# EAGLE design lia_breakout (EAGLE 6.5.0)

## Sheet 1 of 3
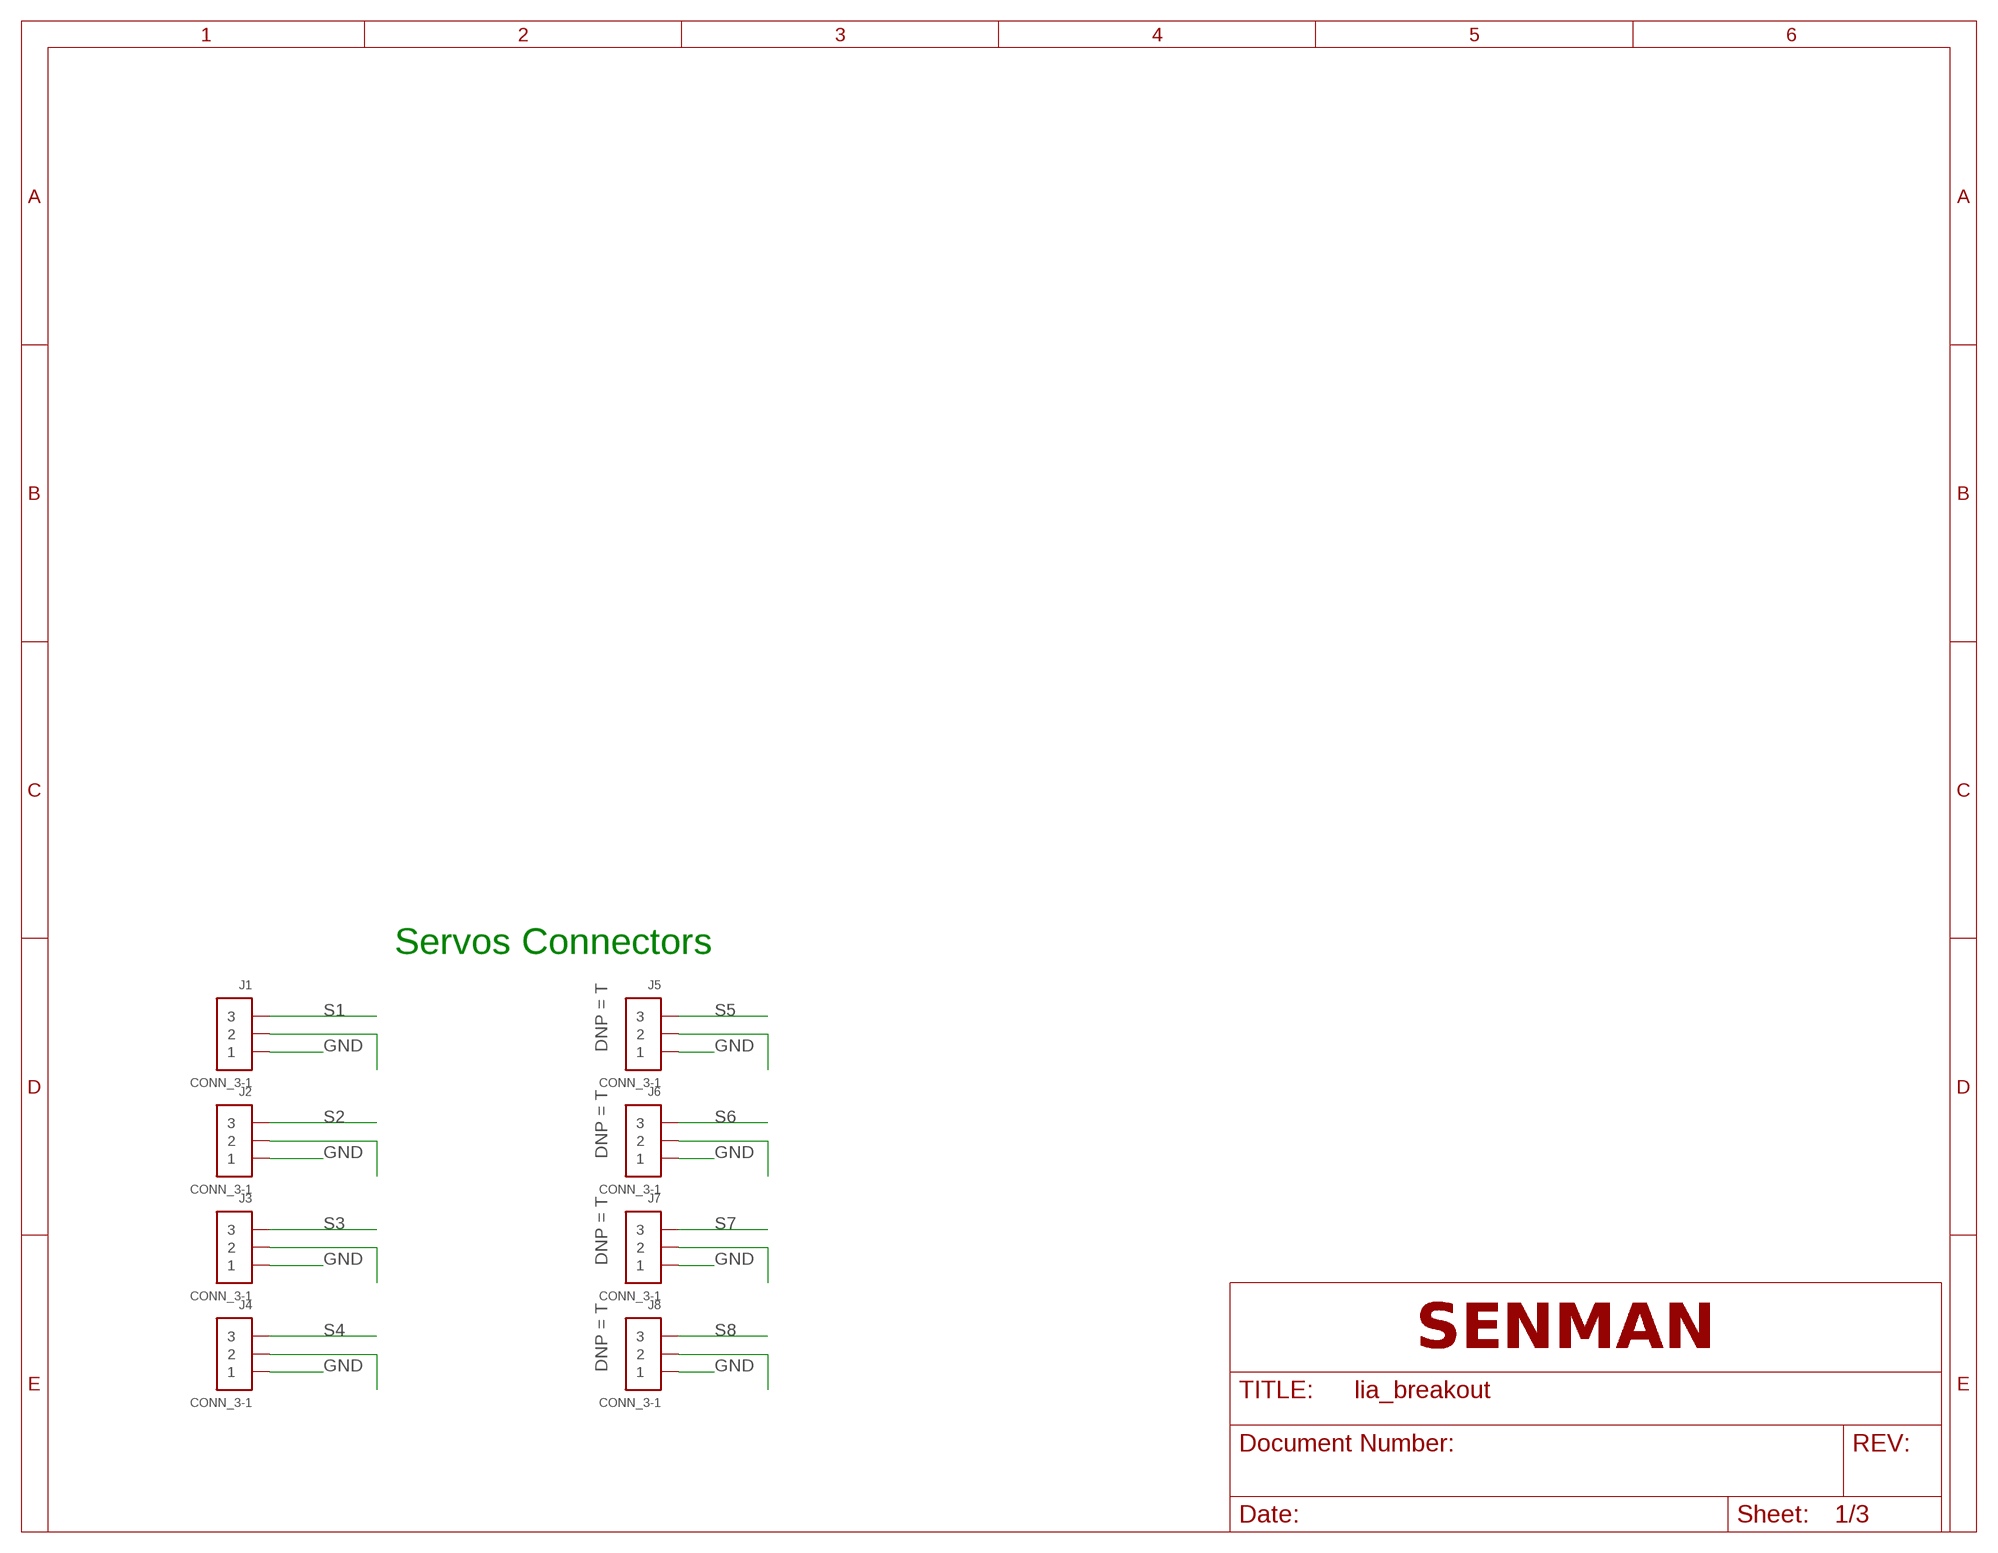
[diagram p0: schematic, sheet 1]

### Parts
J1  CONN_3-1  [SIP1X3_100]
J2  CONN_3-1  [SIP1X3_100]
J3  CONN_3-1  [SIP1X3_100]
J4  CONN_3-1  [SIP1X3_100]
J5  CONN_3-1  [SIP1X3_100]
J6  CONN_3-1  [SIP1X3_100]
J7  CONN_3-1  [SIP1X3_100]
J8  CONN_3-1  [SIP1X3_100]

### Nets
GND: J1.1 J2.1 J3.1 J4.1 J5.1 J6.1 J7.1 J8.1 ; also sheet 2,3
N$2: J5.2
N$3: J6.2
N$16: J7.2
N$17: J8.2
N$18: J4.2
N$19: J3.2
N$20: J2.2
N$21: J1.2
S1: J1.3
S2: J2.3
S3: J3.3
S4: J4.3
S5: J5.3
S6: J6.3
S7: J7.3
S8: J8.3

### Notes on the sheet
- Servos Connectors

## Sheet 2 of 3
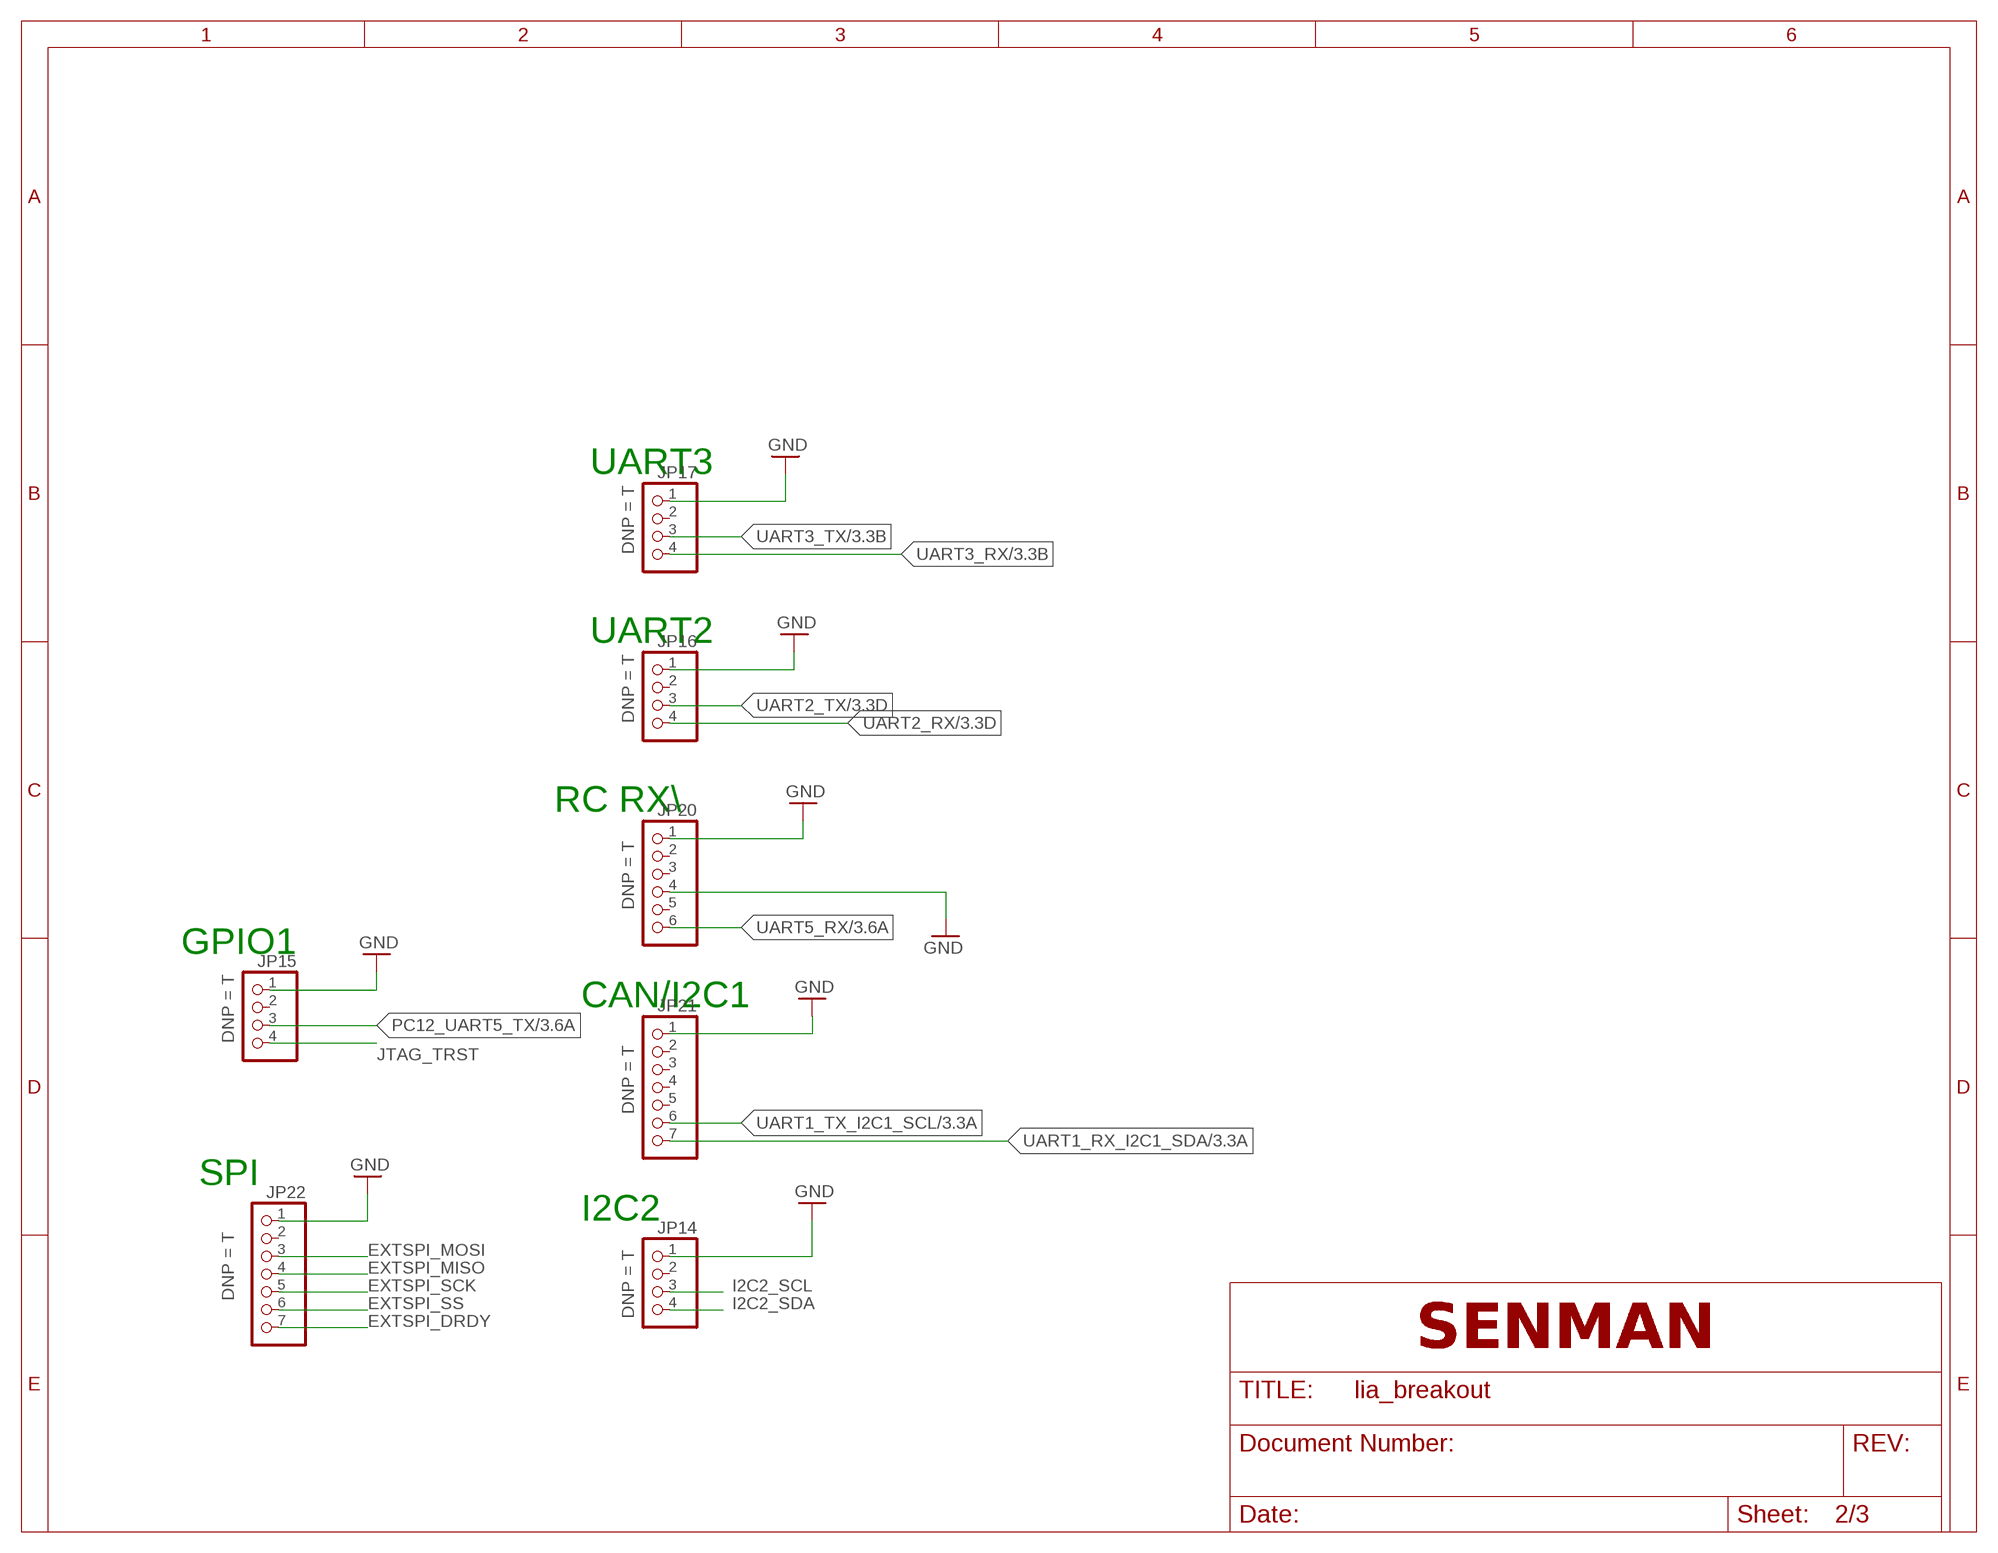
[diagram p1: schematic, sheet 2]

### Parts
JP14  PINHD-1X4  [1X04]
JP15  PINHD-1X4  [1X04]
JP16  PINHD-1X4  [1X04]
JP17  PINHD-1X4  [1X04]
JP20  PINHD-1X6  [1X06]
JP21  PINHD-1X7  [1X07]
JP22  PINHD-1X7  [1X07]

### Nets
EXTSPI_DRDY: JP22.7
EXTSPI_MISO: JP22.4
EXTSPI_MOSI: JP22.3
EXTSPI_SCK: JP22.5
EXTSPI_SS: JP22.6
GND: JP14.1 JP15.1 JP16.1 JP17.1 JP20.1 JP20.4 JP21.1 JP22.1 ; also sheet 1,3
I2C2_SCL: JP14.3
I2C2_SDA: JP14.4
JTAG_TRST: JP15.4
PC12_UART5_TX: JP15.3 ; also sheet 3
UART1_RX_I2C1_SDA: JP21.7 ; also sheet 3
UART1_TX_I2C1_SCL: JP21.6 ; also sheet 3
UART2_RX: JP16.4 ; also sheet 3
UART2_TX: JP16.3 ; also sheet 3
UART3_RX: JP17.4 ; also sheet 3
UART3_TX: JP17.3 ; also sheet 3
UART5_RX: JP20.6 ; also sheet 3
Unconnected: JP14.2 JP15.2 JP16.2 JP17.2 JP20.2 JP20.3 JP20.5 JP21.2 JP21.3 JP21.4 JP21.5 JP22.2

### Notes on the sheet
- UART3
- UART2
- RC RX\
- GPIO1
- CAN/I2C1
- SPI
- I2C2

## Sheet 3 of 3
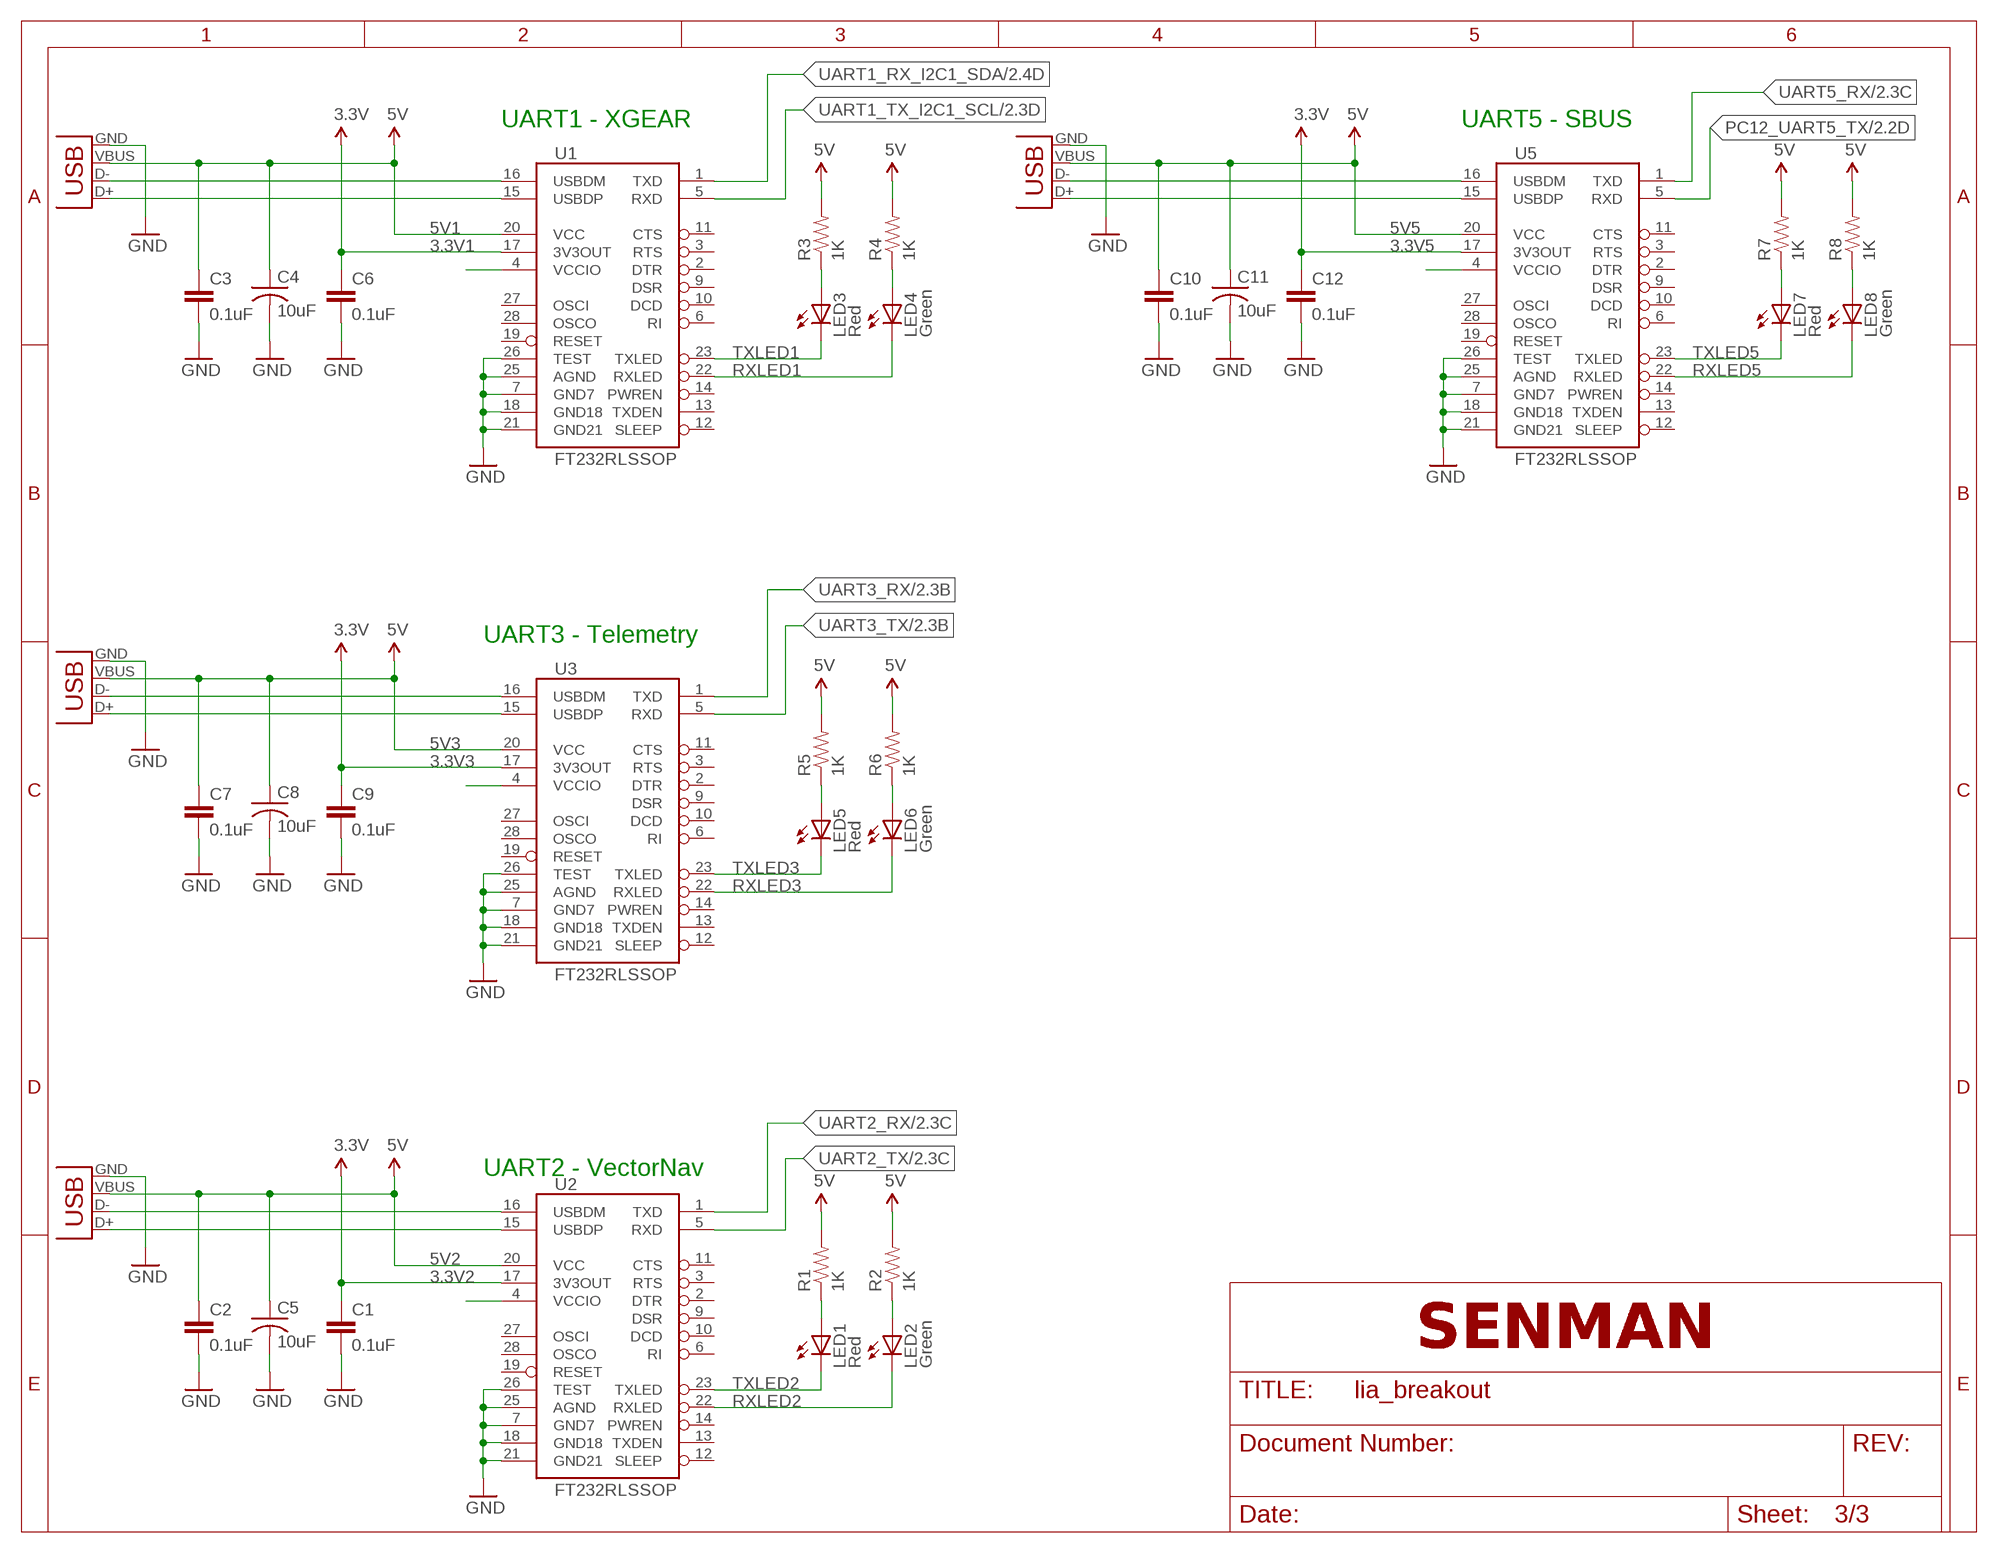
[diagram p2: schematic, sheet 3]

### Parts
C1  0.1uF  CAP0603-CAP  [0603-CAP]
C2  0.1uF  CAP0603-CAP  [0603-CAP]
C3  0.1uF  CAP0603-CAP  [0603-CAP]
C4  10uF  C-USC0603  [C0603]
C5  10uF  C-USC0603  [C0603]
C6  0.1uF  CAP0603-CAP  [0603-CAP]
C7  0.1uF  CAP0603-CAP  [0603-CAP]
C8  10uF  C-USC0603  [C0603]
C9  0.1uF  CAP0603-CAP  [0603-CAP]
C10  0.1uF  CAP0603-CAP  [0603-CAP]
C11  10uF  C-USC0603  [C0603]
C12  0.1uF  CAP0603-CAP  [0603-CAP]
LED1  Red  LED0603  [LED-0603]
LED2  Green  LED0603  [LED-0603]
LED3  Red  LED0603  [LED-0603]
LED4  Green  LED0603  [LED-0603]
LED5  Red  LED0603  [LED-0603]
LED6  Green  LED0603  [LED-0603]
LED7  Red  LED0603  [LED-0603]
LED8  Green  LED0603  [LED-0603]
R1  1K  RESISTOR0603-RES  [0603-RES]
R2  1K  RESISTOR0603-RES  [0603-RES]
R3  1K  RESISTOR0603-RES  [0603-RES]
R4  1K  RESISTOR0603-RES  [0603-RES]
R5  1K  RESISTOR0603-RES  [0603-RES]
R6  1K  RESISTOR0603-RES  [0603-RES]
R7  1K  RESISTOR0603-RES  [0603-RES]
R8  1K  RESISTOR0603-RES  [0603-RES]
U1  FT232RLSSOP  [SSOP28DB]
U2  FT232RLSSOP  [SSOP28DB]
U3  FT232RLSSOP  [SSOP28DB]
U5  FT232RLSSOP  [SSOP28DB]
X1  USB-SMD-NS  [USB-MINIB-NOSTOP]
X2  USB-SMD-NS  [USB-MINIB-NOSTOP]
X3  USB-SMD-NS  [USB-MINIB-NOSTOP]
X4  USB-SMD-NS  [USB-MINIB-NOSTOP]

### Nets
3.3V1 [supply]: C6.1 U1.17(3V3OUT) ; supply symbol labelled 3.3V
3.3V2 [supply]: C1.1 U2.17(3V3OUT) ; supply symbol labelled 3.3V
3.3V3 [supply]: C9.1 U3.17(3V3OUT) ; supply symbol labelled 3.3V
3.3V5 [supply]: C12.1 U5.17(3V3OUT) ; supply symbol labelled 3.3V
5V1: C3.1 C4.1 R3.2 R4.2 U1.20(VCC) X1.VBUS ; supply symbol labelled 5V
5V2: C2.1 C5.1 R1.2 R2.2 U2.20(VCC) X2.VBUS ; supply symbol labelled 5V
5V3: C7.1 C8.1 R5.2 R6.2 U3.20(VCC) X3.VBUS ; supply symbol labelled 5V
5V5: C10.1 C11.1 R7.2 R8.2 U5.20(VCC) X4.VBUS ; supply symbol labelled 5V
GND: C1.2 C2.2 C3.2 C4.2 C5.2 C6.2 C7.2 C8.2 C9.2 C10.2 C11.2 C12.2 U1.7(GND7) U1.18(GND18) U1.21(GND21) U1.25(AGND) U1.26(TEST) U2.7(GND7) U2.18(GND18) U2.21(GND21) U2.25(AGND) U2.26(TEST) U3.7(GND7) U3.18(GND18) U3.21(GND21) U3.25(AGND) U3.26(TEST) U5.7(GND7) U5.18(GND18) U5.21(GND21) U5.25(AGND) U5.26(TEST) X1.GND X2.GND X3.GND X4.GND ; also sheet 1,2
N$1: LED1.A R1.1
N$4: LED2.A R2.1
N$5: LED3.A R3.1
N$6: LED4.A R4.1
N$7: LED5.A R5.1
N$8: LED6.A R6.1
N$9: LED7.A R7.1
N$10: LED8.A R8.1
N$11: U2.4(VCCIO)
N$12: U3.4(VCCIO)
N$13: U1.4(VCCIO)
N$14: U5.4(VCCIO)
PC12_UART5_TX: U5.5(RXD) ; also sheet 2
RXLED1: LED4.C U1.22(RXLED)
RXLED2: LED2.C U2.22(RXLED)
RXLED3: LED6.C U3.22(RXLED)
RXLED5: LED8.C U5.22(RXLED)
TXLED1: LED3.C U1.23(TXLED)
TXLED2: LED1.C U2.23(TXLED)
TXLED3: LED5.C U3.23(TXLED)
TXLED5: LED7.C U5.23(TXLED)
UART1_RX_I2C1_SDA: U1.1(TXD) ; also sheet 2
UART1_TX_I2C1_SCL: U1.5(RXD) ; also sheet 2
UART2_RX: U2.1(TXD) ; also sheet 2
UART2_TX: U2.5(RXD) ; also sheet 2
UART3_RX: U3.1(TXD) ; also sheet 2
UART3_TX: U3.5(RXD) ; also sheet 2
UART5_RX: U5.1(TXD) ; also sheet 2
USB_D+: U2.15(USBDP) X2.D+
USB_D+1: U1.15(USBDP) X1.D+
USB_D+2: U3.15(USBDP) X3.D+
USB_D+3: U5.15(USBDP) X4.D+
USB_D-: U2.16(USBDM) X2.D-
USB_D-1: U1.16(USBDM) X1.D-
USB_D-2: U3.16(USBDM) X3.D-
USB_D-3: U5.16(USBDM) X4.D-
Unconnected: U1.2(DTR) U1.3(RTS) U1.6(RI) U1.9(DSR) U1.10(DCD) U1.11(CTS) U1.12(SLEEP) U1.13(TXDEN) U1.14(PWREN) U1.19(RESET) U1.27(OSCI) U1.28(OSCO) U2.2(DTR) U2.3(RTS) U2.6(RI) U2.9(DSR) U2.10(DCD) U2.11(CTS) U2.12(SLEEP) U2.13(TXDEN) U2.14(PWREN) U2.19(RESET) U2.27(OSCI) U2.28(OSCO) U3.2(DTR) U3.3(RTS) U3.6(RI) U3.9(DSR) U3.10(DCD) U3.11(CTS) U3.12(SLEEP) U3.13(TXDEN) U3.14(PWREN) U3.19(RESET) U3.27(OSCI) U3.28(OSCO) U5.2(DTR) U5.3(RTS) U5.6(RI) U5.9(DSR) U5.10(DCD) U5.11(CTS) U5.12(SLEEP) U5.13(TXDEN) U5.14(PWREN) U5.19(RESET) U5.27(OSCI) U5.28(OSCO)

### Notes on the sheet
- UART1 - XGEAR | UART5 - SBUS
- UART3 - Telemetry
- UART2 - VectorNav

## Library data of the parts
C1-C3 C6 C7 C9 C10 C12 = SparkFun-Passives:CAP: Capacitor Standard 0603 ceramic capacitor, and 0.1" leaded capacitor.
C4 C5 C8 C11 = rcl:C-US: CAPACITOR, American symbol
J1-J4 = pel_misc:CONN_3-1; PARTNO: conn-th-0.1in-3-2-ra
J5-J8 = pel_misc:CONN_3-1; DNP: T; PARTNO: conn-th-0.1in-3-2-ra
JP14-JP17 = pinhead:PINHD-1X4: PIN HEADER; DNP: T; PARTNO: conn-th-0.1in-4-1
JP20 = pinhead:PINHD-1X6: PIN HEADER; DNP: T; PARTNO: conn-th-0.1in-6-1
JP21 JP22 = pinhead:PINHD-1X7: PIN HEADER; DNP: T; PARTNO: conn-th-0.1in-7-1
LED1-LED8 = SparkFun:LED: LEDs Standard schematic elements and footprints for 5mm, 3mm, 1206, and 0603 sized LEDs. 5mm - Spark Fun Electronics SKU : COM-00529 (and others)
R1-R8 = SparkFun-Passives:RESISTOR: Resistor Basic schematic elements and footprints for 0603, 1206, and PTH resistors.
U1-U3 U5 = SparkFun:FT232RL: USB UART FT232RL 4th Generation USB UART (USB <-> Serial) Controller. Spark Fun Electronics SKU : COM-00650
X1-X4 = SparkFun:USB: USB Connectors USB-B-PTH is fully proven SKU : PRT-00139 USB-miniB is fully proven SKU : PRT-00587 USB-A-PCB is untested. USB-A-H is throughly reviewed, but untested. Spark Fun Electronics SKU : PRT-00437 USB-B-SMT is throughly reviewed, but untested. Needs silkscreen touching up. USB-A-S has not been used/tested USB-MB-H has not been used/tested

## Net classes
0 default: width 0.152 mm, drill 0.305 mm, clearance 0.152 mm
4 xxwide: width 0.203 mm
5 USB: width 0.14 mm

## Board
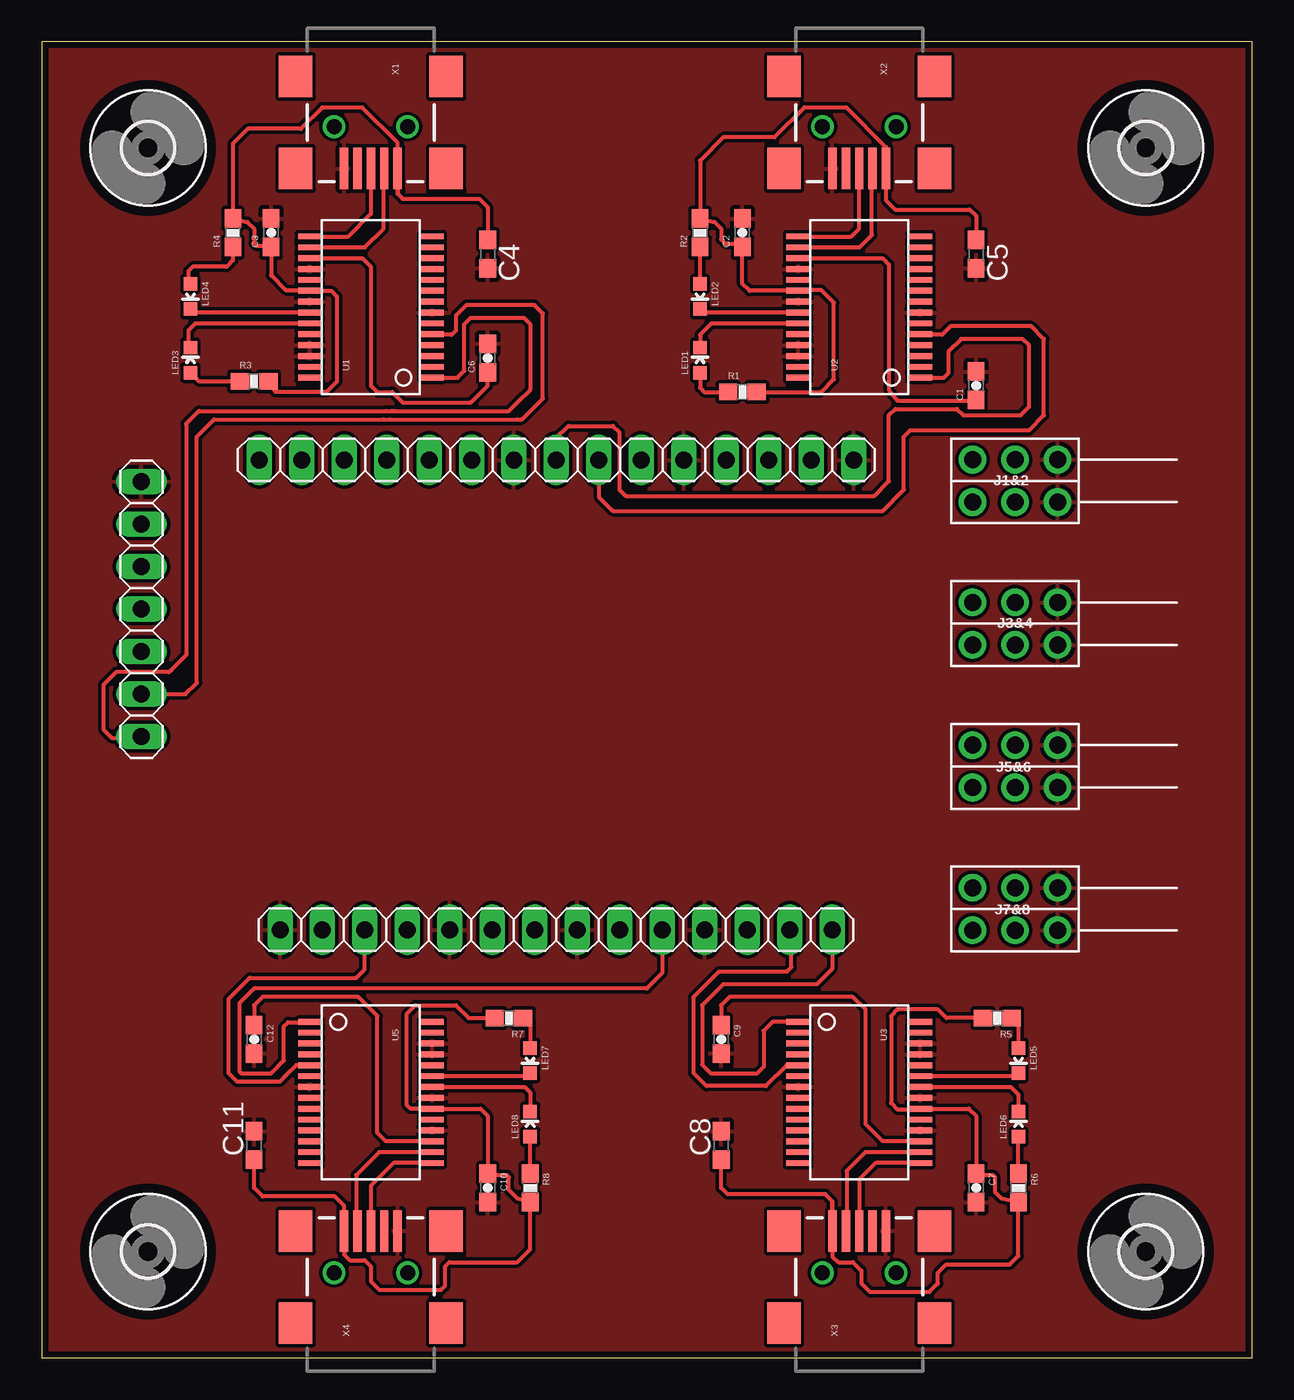
[diagram p3: board, top side]

Size 72.39 x 78.74 mm. Coordinates in mm from the lower left corner, seen from the top.
Outline: 0,0 72.39,0 72.39,78.74 0,78.74 0,0
Copper layers (1*16): Top 0.0178mm / dielectric 59mil / Bottom 0.0178mm
Design rules "epl-lpkf": minimum track width 8mil, minimum drill 0.35mm, track to track 8mil, track to pad 8mil, pad to pad 8mil, via to via 8mil, smd to smd 8mil, copper to edge 15mil, drill to drill 15mil, minimum pad ring 8mil, minimum via ring 8mil, stop-mask expansion 3mil, vias tented up to drill 0mil, thermal gap 10mil
tKeepout: area 12.7,74.9 to 26.7,80; area 41.9,74.9 to 55.9,80; area 12.7,-1.3 to 26.7,3.8; area 41.9,-1.3 to 55.9,3.8; area -1.3,22.9 to 2.5,36.8

### Footprints (pad centres in the part's own frame; a part is rotated, then mirrored left to right if it is on the bottom)
0603-CAP = smd 1.1 x 1: 1 -0.85,0; 2 0.85,0
C0603 = smd 1.1 x 1: 1 -0.85,0; 2 0.85,0
SIP1X3_100 = drill 1.016 pad 1.651: 1 2.54,0; 2 0,0; 3 -2.54,0
1X04 = drill 1.016 long: 1 -3.81,0; 2 -1.27,0; 3 1.27,0; 4 3.81,0
1X06 = drill 1.016 long: 1 -6.35,0; 2 -3.81,0; 3 -1.27,0; 4 1.27,0; 5 3.81,0; 6 6.35,0
1X07 = drill 1.016 long: 1 -7.62,0; 2 -5.08,0; 3 -2.54,0; 4 0,0; 5 2.54,0; 6 5.08,0; 7 7.62,0
LED-0603 = smd 0.8 x 0.8: A 0,-0.75; C 0,0.75
0603-RES = smd 1.1 x 1: 1 -0.85,0; 2 0.85,0
SSOP28DB = smd 0.348 x 1.397: 1 -4.225,-3.656; 2 -3.575,-3.656; 3 -2.925,-3.656; 4 -2.275,-3.656; 5 -1.625,-3.656; 6 -0.975,-3.656; 7 -0.325,-3.656; 8 0.325,-3.656; 9 0.975,-3.656; 10 1.625,-3.656; 11 2.275,-3.656; 12 2.925,-3.656; 13 3.575,-3.656; 14 4.225,-3.656; 15 4.225,3.656; 16 3.575,3.656; 17 2.925,3.656; 18 2.275,3.656; 19 1.625,3.656; 20 0.975,3.656; 21 0.325,3.656; 22 -0.325,3.656; 23 -0.975,3.656; 24 -1.625,3.656; 25 -2.275,3.656; 26 -2.925,3.656; 27 -3.575,3.656; 28 -4.225,3.656
3,0 = hole 3: 0,0
USB-MINIB-NOSTOP = smd 2.5 x 0.5: D+ 2.5,0; D- 2.5,0.8; GND 2.5,-1.6; ID 2.5,-0.8; VBUS 2.5,1.6 | smd 2.5 x 2: G1 -3,-4.5; G2 -3,4.5; G3 2.5,4.5; G4 2.5,-4.5 | drill 0.9 pad 0.8: H1 0,2.2 | drill 0.9 pad 0.787: H2 0,-2.2

### Placement (x,y rotation side)
C1  55.88,58.17 90 top
C2  41.91,67.31 90 top
C3  13.72,67.31 90 top
C4  26.67,66.04 270 top
C5  55.88,66.04 270 top
C6  26.67,59.82 90 top
C7  55.88,10.16 270 top
C8  40.64,12.7 90 top
C9  40.64,19.05 270 top
C10  26.67,10.16 270 top
C11  12.7,12.7 90 top
C12  12.7,19.05 270 top
J1  58.22,53.74 0 top
J2  58.22,51.2 0 top
J3  58.22,45.2 0 top
J4  58.22,42.66 0 top
J5  58.22,36.66 0 top
J6  58.22,34.12 0 top
J7  58.22,28.12 0 top
J8  58.22,25.58 0 top
JP14  44.75,53.72 180 top
JP15  18.06,25.6 0 top
JP16  34.59,53.72 180 top
JP17  43.46,25.6 0 top
JP20  30.76,25.6 0 top
JP21  5.96,44.79 270 top
JP22  20.62,53.72 180 top
LED1  39.37,59.69 0 top
LED2  39.37,63.5 180 top
LED3  8.89,59.69 0 top
LED4  8.89,63.5 180 top
LED5  58.42,17.78 180 top
LED6  58.42,13.97 0 top
LED7  29.21,17.78 180 top
LED8  29.21,13.97 0 top
R1  41.91,57.78 0 top
R2  39.37,67.31 90 top
R3  12.7,58.42 0 top
R4  11.43,67.31 90 top
R5  57.15,20.32 180 top
R6  58.42,10.16 270 top
R7  27.94,20.32 180 top
R8  29.21,10.16 270 top
U1  19.68,62.87 90 top
U2  48.9,62.87 90 top
U3  48.9,15.88 270 top
U5  19.68,15.88 270 top
U$13  [3,0]  6.35,6.35 0 top
U$14  [3,0]  6.35,72.39 0 top
U$15  [3,0]  66.04,72.39 0 top
U$16  [3,0]  66.04,6.35 0 top
X1  19.68,73.66 270 top
X2  48.9,73.66 270 top
X3  48.9,5.08 90 top
X4  19.68,5.08 90 top

### Tracks (layer width: path | path; a pad name or v marks a point on that pad's centre or on a via)
3.3V1
  Top 0.254: U1.17 19.17,65.79 19.68,65.28 19.68,58.17 20.07,57.78 20.95,57.78 21.59,57.15 25.65,57.15 26.29,57.78 26.67,58.17 C6.1
3.3V2
  Top 0.254: U2.17 50.29,65.79 50.67,65.41 50.67,57.91 51.18,57.28 55.64,57.28 C1.1
3.3V3
  Top 0.254: U3.17 50.3,12.95 49.28,13.97 49.28,20.83 48.51,21.59 41.15,21.59 40.64,21.08 C9.1
3.3V5
  Top 0.254: U5.17 20.58,12.95 20.07,13.46 20.07,20.45 18.92,21.59 13.21,21.59 12.7,21.08 C12.1
5V1
  Top 0.254: X1.VBUS 21.29,69.65 | 21.29,69.65 21.59,69.34 26.16,69.34 26.67,68.83 C4.1 | 21.29,69.65 21.29,72.69 19.18,74.8 16.76,74.8 15.49,73.53 12.32,73.53 11.43,72.64 R4.2 12.3,67.96 12.7,67.56 12.7,66.67 12.83,66.55 13.6,66.55 C3.1 13.72,64.77 14.61,63.88 15.99,63.88 U1.20 17.31,63.84 17.65,63.5 17.65,58.42 17.02,57.78 13.98,57.78 R3.2
5V2
  Top 0.254: R1.2 46.61,57.78 47.37,58.55 47.37,63.12 46.61,63.88 45.72,63.88 | 45.72,63.88 45.28,63.88 | 45.72,63.88 45.68,63.84 U2.20 42.33,63.84 41.91,64.26 C2.1 41.91,66.66 41.9,66.67 40.89,66.67 40.64,66.93 40.64,67.56 40.24,67.96 R2.2 39.37,71.63 40.77,73.03 43.81,73.03 45.59,74.8 48.13,74.8 50.49,72.44 X2.VBUS 50.49,69.27 51.05,68.71 55.5,68.71 55.88,68.33 C5.1
5V3
  Top 0.254: X3.VBUS 47.3,9.35 | 47.3,9.35 46.86,9.78 41.02,9.78 40.64,10.16 C8.1 | 47.3,9.35 47.3,6.04 47.62,5.71 48.51,5.71 49.02,5.21 49.02,4.45 49.53,3.94 53.09,3.94 53.59,4.45 53.59,5.08 54.1,5.59 57.91,5.59 58.42,6.1 R6.2 57.42,9.51 57.02,9.91 57.02,10.79 56.9,10.92 55.99,10.92 C7.1 55.88,14.48 55.46,14.9 U3.20 52.51,14.86 51.18,14.86 50.8,15.24 50.8,20.45 51.18,20.83 53.59,20.83 54.1,20.32 R5.2
5V5
  Top 0.254: R7.2 25.53,20.32 24.77,21.08 22.35,21.08 21.84,20.57 21.84,15.11 22.06,14.9 U5.20 26.25,14.9 26.67,14.48 C10.1 26.78,10.92 27.81,10.92 27.94,10.79 27.94,10.03 28.46,9.51 R8.2 29.21,6.48 28.45,5.71 24.38,5.71 24.13,5.46 24.13,4.32 23.88,4.06 20.19,4.06 19.68,4.57 19.68,5.46 19.3,5.84 18.41,5.84 18.09,6.17 X4.VBUS 18.09,9.09 17.53,9.65 13.21,9.65 12.7,10.16 C11.1
GND
  pour Top: 0,0 0,78.74 72.39,78.74 72.39,0
N$1
  Top 0.254: LED1.A 39.37,58.04 39.62,57.78 R1.1
N$4
  Top 0.254: LED2.A R2.1
N$5
  Top 0.254: R3.1 9.41,58.42 LED3.A
N$6
  Top 0.254: R4.1 11.43,65.66 11.05,65.28 9.02,65.28 8.76,65.02 8.76,64.38 LED4.A
N$7
  Top 0.254: R5.1 58.29,20.32 58.42,20.19 LED5.A
N$8
  Top 0.254: R6.1 LED6.A
N$9
  Top 0.254: R7.1 29.08,20.32 29.21,20.19 LED7.A
N$10
  Top 0.254: R8.1 LED8.A
PC12_UART5_TX
  Top 0.254: U5.5 15.21,17.5 14.61,16.89 14.22,16.51 11.68,16.51 11.18,17.02 11.18,21.46 12.45,22.73 18.8,22.73 19.3,23.24 19.3,25.57 JP15.3
RXLED1
  Top 0.254: U1.22 9.1,62.54 LED4.C
RXLED2
  Top 0.254: U2.22 39.58,62.54 LED2.C
RXLED3
  Top 0.254: U3.22 57.97,16.2 58.42,15.75 LED6.C
RXLED5
  Top 0.254: U5.22 28.89,16.2 29.21,15.88 LED8.C
TXLED1
  Top 0.254: U1.23 9.19,61.89 8.76,61.47 8.76,60.57 LED3.C
TXLED2
  Top 0.254: U2.23 40.05,61.89 39.37,61.21 LED1.C
TXLED3
  Top 0.254: U3.23 58.24,16.85 LED5.C
TXLED5
  Top 0.254: U5.23 29.03,16.85 LED7.C
UART1_RX_I2C1_SDA
  Top 0.254: U1.1 24.86,58.64 25.27,59.05 25.27,61.85 25.65,62.23 28.83,62.23 29.21,61.85 29.21,57.91 28.45,57.15 27.94,56.64 21.08,56.64 20.95,56.64 20.57,56.64 9.4,56.64 8.64,55.88 8.64,42.04 7.75,41.15 7.62,41.02 4.45,41.02 3.68,40.26 3.68,37.59 4.19,37.08 5.87,37.08 JP21.7
UART1_TX_I2C1_SCL
  Top 0.254: JP21.6 8.6,39.71 9.27,40.39 9.27,55.12 10.29,56.13 20.45,56.13 20.83,56.13 28.45,56.13 28.7,56.13 29.97,57.4 29.97,62.48 29.46,62.99 25.4,62.99 24.77,62.36 24.77,61.47 24.51,61.21 23.37,61.21 U1.5
UART2_RX
  Top 0.254: U2.1 53.94,58.64 54.23,58.93 54.23,60.2 54.99,60.96 58.67,60.96 59.05,60.58 59.05,56.9 58.55,56.39 55.12,56.39 54.74,56.77 51.05,56.77 50.67,56.39 50.67,52.45 49.78,51.56 34.92,51.56 34.54,51.94 34.54,55.37 34.16,55.75 31.5,55.75 30.78,55.04 JP16.4
UART2_TX
  Top 0.254: 52.58,61.21 U2.5 52.58,61.21 | 52.58,61.21 53.85,61.21 54.36,61.72 59.18,61.72 59.94,60.96 59.94,56.39 59.05,55.5 57.15,55.5 54.86,55.5 54.23,55.5 51.94,55.5 51.56,55.12 51.56,51.94 50.29,50.67 34.16,50.67 33.32,51.51 JP16.3
UART3_RX
  Top 0.254: JP17.4 47.27,23.27 46.35,22.35 40.77,22.35 39.5,21.08 39.5,17.53 40.01,17.02 42.8,17.02 43.18,17.4 43.18,19.56 43.72,20.1 U3.1
UART3_TX
  Top 0.254: U3.5 44.55,17.5 43.31,16.26 39.75,16.26 38.99,17.02 38.99,21.59 40.51,23.11 44.58,23.11 44.83,23.37 44.83,25.5 JP17.3
UART5_RX
  Top 0.254: JP20.6 37.11,23.01 36.2,22.1 12.7,22.1 11.81,21.21 11.81,17.14 11.94,17.02 13.72,17.02 14.48,17.78 14.48,19.81 14.73,20.07 15.99,20.07 U5.1
USB_D+
  Top 0.254: U2.15 48.42,67.09 48.9,67.56 X2.D+
USB_D+1
  Top 0.254: X1.D+ 19.68,68.45 18.29,67.06 16.06,67.06 U1.15
USB_D+2
  Top 0.254: U3.15 49.88,11.65 48.9,10.67 X3.D+
USB_D+3
  Top 0.254: U5.15 21.05,11.65 19.68,10.29 X4.D+
USB_D-
  Top 0.254: U2.16 48.91,66.44 49.66,67.18 49.66,71.12 X2.D-
USB_D-1
  Top 0.254: U1.16 19.32,66.44 20.45,67.56 20.45,71.12 X1.D-
USB_D-2
  Top 0.254: U3.16 49.26,12.3 48.13,11.18 48.13,7.62 X3.D-
USB_D-3
  Top 0.254: U5.16 20.17,12.3 18.8,10.92 18.8,7.67 X4.D-

### Text on the board
tNames: J1&2 | J3&4 | J5&6 | J7&8
Measures: M3
Reference: (C) 2010-2011 Antoine Drouin <poinix@gmail.com> | Licensed under: | (C) 2010-2012 Piotr Esden-Tempski <piotr@esden.net> | CC-BY-SA 3.0 | (C) 2011 Richard Hatano <rhatano@jobyenergy.com> | (C) 2011-2012 Transition Robotics <info@transition-robotics.com> | http://creativecommons.org/licenses/by-sa/3.0/